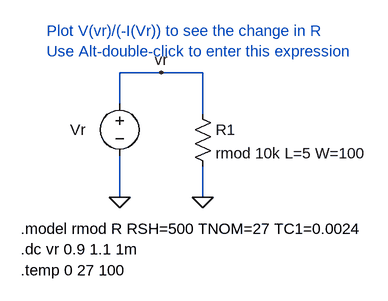
[diagram p0: schematic Fig5_2.asc]
Fig5_2.asc, the LTspice schematic file:
Version 4
SHEET 1 1064 696
WIRE 336 256 336 208
WIRE 336 400 336 336
WIRE 400 208 336 208
WIRE 464 208 400 208
WIRE 464 272 464 208
WIRE 464 400 464 352
FLAG 336 400 0
FLAG 464 400 0
FLAG 400 208 vr
SYMBOL voltage 336 240 R0
WINDOW 0 -76 56 Left 0
WINDOW 3 -74 85 Invisible 0
WINDOW 123 0 0 Left 0
WINDOW 39 0 0 Left 0
SYMATTR InstName Vr
SYMATTR Value 1
SYMBOL res 448 256 R0
SYMATTR InstName R1
SYMATTR Value rmod 10k L=5 W=100
TEXT 184 448 Left 0 !.model rmod R RSH=500 TNOM=27 TC1=0.0024
TEXT 184 480 Left 0 !.dc vr 0.9 1.1 1m
TEXT 184 512 Left 0 !.temp 0 27 100
TEXT 224 144 Left 0 ;Plot V(vr)/(-I(Vr)) to see the change in R\nUse Alt-double-click to enter this expression

The netlist it stands for:
* Fig5_2.asc
Vr vr 0 1
R1 vr 0 rmod 10k L=5 W=100
.model rmod R RSH=500 TNOM=27 TC1=0.0024
.dc vr 0.9 1.1 1m
.temp 0 27 100
* Plot V(vr)/(-I(Vr)) to see the change in R
* Use Alt-double-click to enter this expression
.backanno
.end